# EAGLE schematic XMICRO-6502 (EAGLE 6.3)

## Sheet 1 of 6: CPU
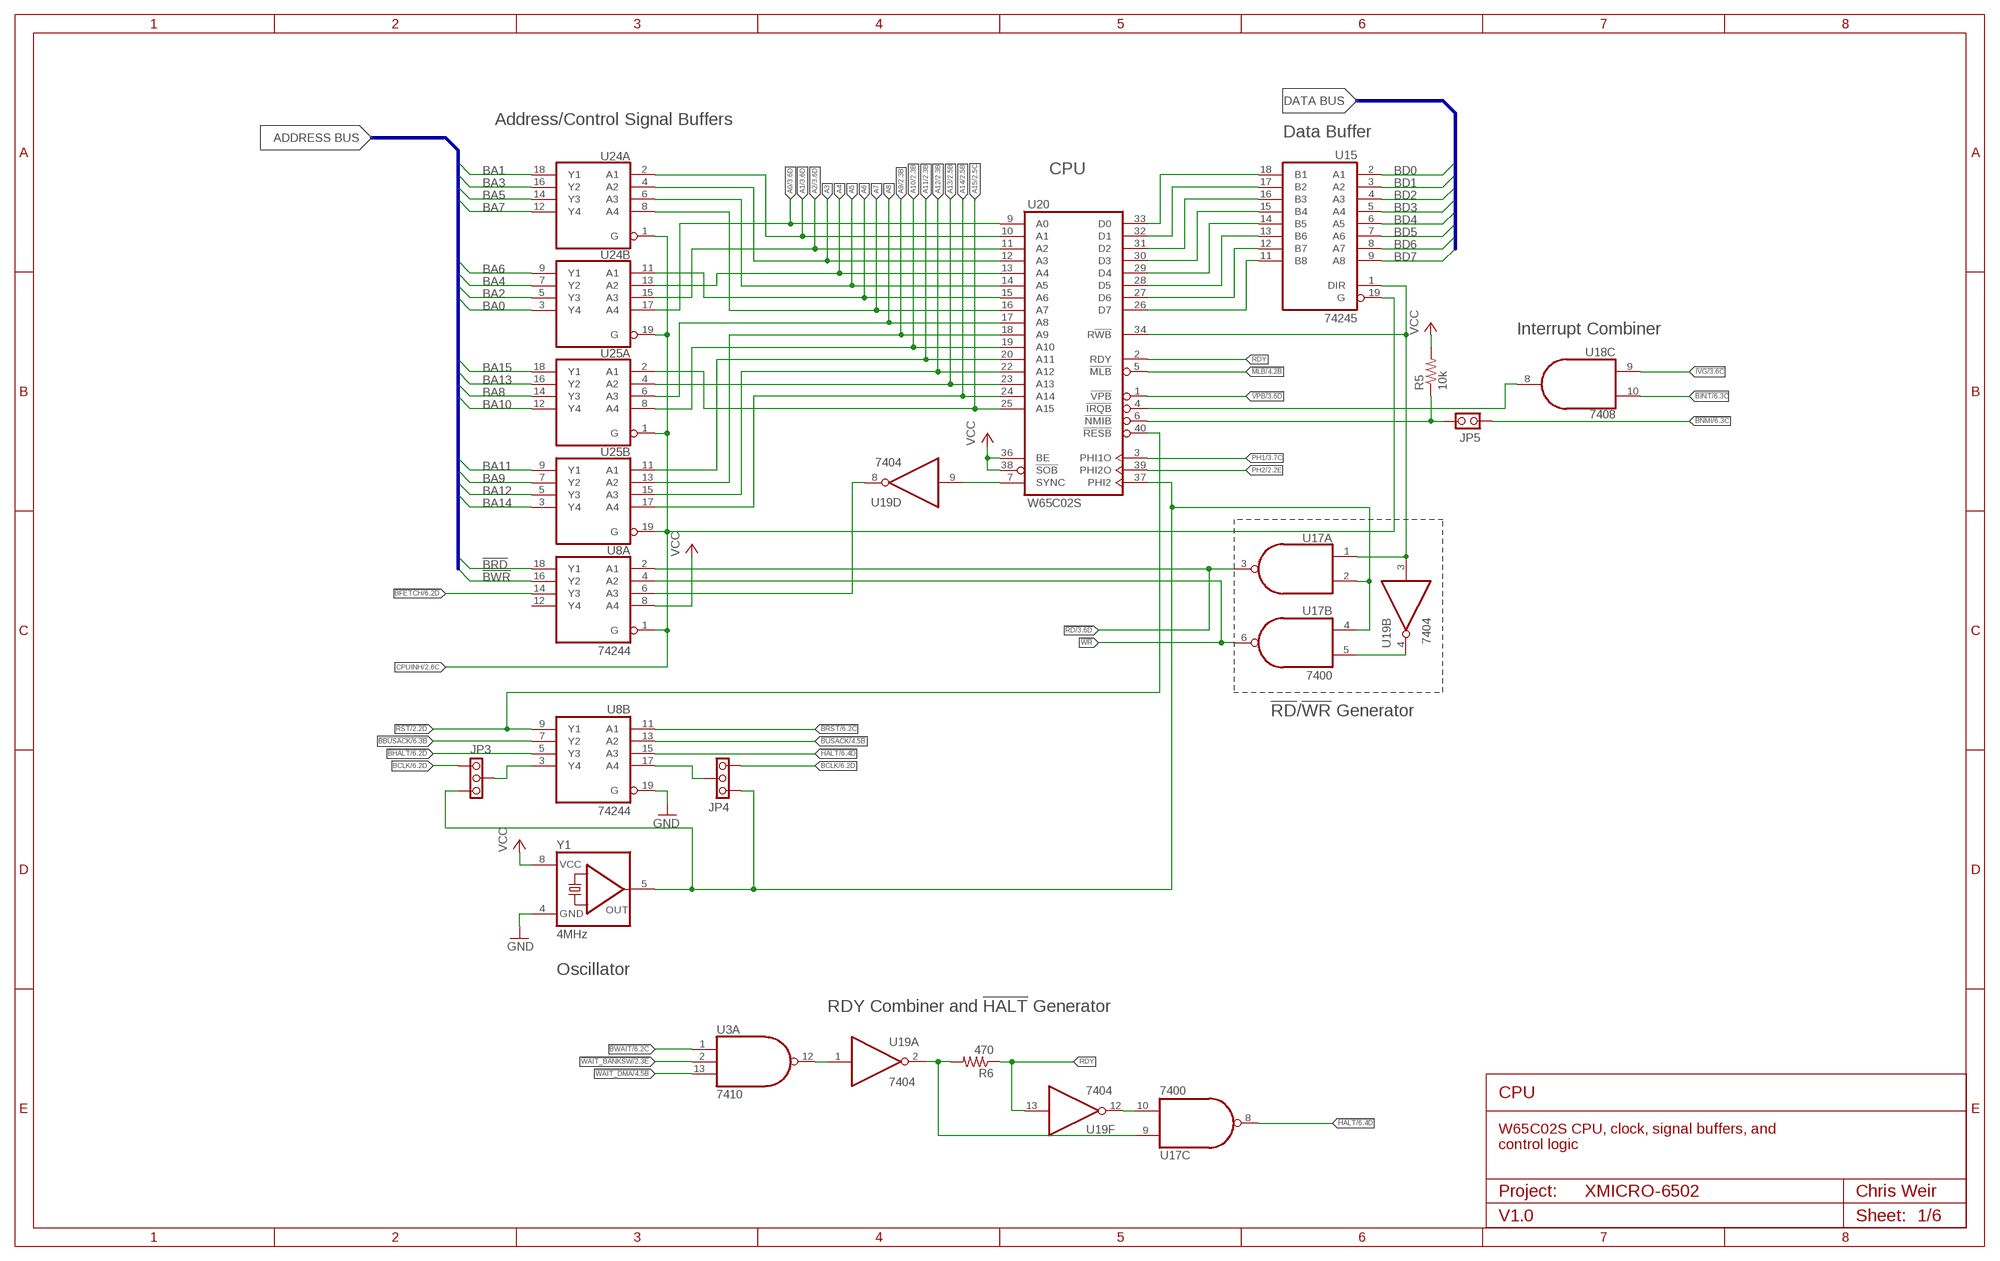
[diagram p0: schematic, sheet 1]

### Parts
JP3  PINHD1X3THRU  [1X03]
JP4  PINHD1X3THRU  [1X03]
JP5  PINHD-1X2THRU  [1X02]
R5  10k  R-US_0207/10  [0207/10]
R6  470  R-US_0207/10  [0207/10]
U3  7410  74LS10N  [DIL14]
U8  74244  74LS244N  [DIL20]
U15  74245  74LS245N  [DIL20]
U17  7400  74LS00N  [DIL14]
U18  7408  74LS08N  [DIL14]
U19  7404  74LS04N  [DIL14]
U20  W65C02S  W65C02P  [DIL40]
U24  74244  74LS244N  [DIL20]
U25  74244  74LS244N  [DIL20]
Y1  4MHz  QG5460  [DIL08S]

### Nets
!BBUSACK: U8.7(B:Y2) ; also sheet 6
!BFETCH: U8.14(A:Y3) ; also sheet 6
!BHALT: U8.5(B:Y3) ; also sheet 6
!BINT: U18.10(C:I1) ; also sheet 6
!BNMI: JP5.1 ; also sheet 6
!BRD: U8.18(A:Y1) ; also sheet 5,6
!BRST: U8.11(B:A1) ; also sheet 6
!BUSACK: U8.13(B:A2) ; also sheet 4
!BWAIT: U3.1(A:I0) ; also sheet 6
!BWR: U8.16(A:Y2) ; also sheet 5,6
!CINT: U18.8(C:O) U20.4(!IRQB)
!HALT: U8.15(B:A3) U17.8(C:O) ; also sheet 6
!IVG: U18.9(C:I0) ; also sheet 3
!MLB: U20.5(!MLB) ; also sheet 4
!RD: U8.2(A:A1) U17.3(A:O) ; also sheet 3
!RST: U8.9(B:Y1) U20.40(!RESB) ; also sheet 2,3,4
!VPB: U20.1(!VPB) ; also sheet 3
!WAIT_BANKSW: U3.2(A:I1) ; also sheet 2
!WAIT_DMA: U3.13(A:I2) ; also sheet 4
!WR: U8.4(A:A2) U17.6(B:O)
A0: U20.9(A0) U24.17(B:A4) ; also sheet 3
A1: U20.10(A1) U24.2(A:A1) ; also sheet 3
A2: U20.11(A2) U24.15(B:A3) ; also sheet 3
A3: U20.12(A3) U24.4(A:A2)
A4: U20.13(A4) U24.13(B:A2)
A5: U20.14(A5) U24.6(A:A3)
A6: U20.15(A6) U24.11(B:A1)
A7: U20.16(A7) U24.8(A:A4)
A8: U20.17(A8) U25.6(A:A3)
A9: U20.18(A9) U25.13(B:A2) ; also sheet 2
A10: U20.19(A10) U25.8(A:A4) ; also sheet 2
A11: U20.20(A11) U25.11(B:A1) ; also sheet 2
A12: U20.22(A12) U25.15(B:A3) ; also sheet 2
A13: U20.23(A13) U25.4(A:A2) ; also sheet 2
A14: U20.24(A14) U25.17(B:A4) ; also sheet 2
A15: U20.25(A15) U25.2(A:A1) ; also sheet 2
BA0: U24.3(B:Y4) ; also sheet 5,6
BA1: U24.18(A:Y1) ; also sheet 6
BA2: U24.5(B:Y3) ; also sheet 6
BA3: U24.16(A:Y2) ; also sheet 6
BA4: U24.7(B:Y2) ; also sheet 6
BA5: U24.14(A:Y3) ; also sheet 5,6
BA6: U24.9(B:Y1) ; also sheet 5,6
BA7: U24.12(A:Y4) ; also sheet 5,6
BA8: U25.14(A:Y3) ; also sheet 6
BA9: U25.7(B:Y2) ; also sheet 6
BA10: U25.12(A:Y4) ; also sheet 6
BA11: U25.9(B:Y1) ; also sheet 6
BA12: U25.5(B:Y3) ; also sheet 6
BA13: U25.16(A:Y2) ; also sheet 6
BA14: U25.3(B:Y4) ; also sheet 6
BA15: U25.18(A:Y1) ; also sheet 6
BCLK: JP3.1 JP4.3 ; also sheet 6
BD0: U15.2(A1) ; also sheet 2,3,5,6
BD1: U15.3(A2) ; also sheet 2,3,5,6
BD2: U15.4(A3) ; also sheet 2,3,5,6
BD3: U15.5(A4) ; also sheet 2,3,5,6
BD4: U15.6(A5) ; also sheet 2,3,5,6
BD5: U15.7(A6) ; also sheet 2,3,5,6
BD6: U15.8(A7) ; also sheet 2,3,5,6
BD7: U15.9(A8) ; also sheet 2,3,5,6
CPUINH: U8.1(A:G) U15.19(G) U24.1(A:G) U24.19(B:G) U25.1(A:G) U25.19(B:G) ; also sheet 2,4
GND [GND]: U8.19(B:G) Y1.4(GND) ; also sheet 2,3,4,6
N$1: U3.12(A:O) U19.1(A:I)
N$2: U17.5(B:I1) U19.4(B:O)
N$4: U15.1(DIR) U17.1(A:I0) U19.3(B:I) U20.34(R!WB)
N$9: JP3.2 U8.3(B:Y4)
N$11: U17.10(C:I1) U19.12(F:O)
N$21: R6.2 U17.9(C:I0) U19.2(A:O)
N$28: U15.11(B8) U20.26(D7)
N$29: U15.12(B7) U20.27(D6)
N$30: U15.13(B6) U20.28(D5)
N$31: U15.14(B5) U20.29(D4)
N$32: U15.15(B4) U20.30(D3)
N$33: U15.16(B3) U20.31(D2)
N$34: U15.17(B2) U20.32(D1)
N$35: U15.18(B1) U20.33(D0)
N$36: JP4.2 U8.17(B:A4)
N$37: JP5.2 R5.1 U20.6(!NMIB)
N$49: U19.9(D:I) U20.7(SYNC)
N$51: U8.6(A:A3) U19.8(D:O)
PH0: JP3.3 JP4.1 U17.2(A:I1) U17.4(B:I0) U20.37(PHI2) Y1.5(OUT)
PH1: U20.3(PHI1O) ; also sheet 3,4
PH2: U20.39(PHI2O) ; also sheet 2,4
RDY: R6.1 U19.13(F:I) U20.2(RDY)
VCC: R5.2 U8.8(A:A4) U20.36(BE) U20.38(!SOB) Y1.8(VCC) ; also sheet 2,3,4,5,6
Unconnected: U8.12(A:Y4)

### Buses
BD[0..7]
BA[0..19],!BRD,!BWR,!BCSX

### Notes on the sheet
- DATA BUS
- Address/Control Signal Buffers
- ADDRESS BUS | Data Buffer
- CPU
- Interrupt Combiner
- !RD!/!WR! Generator
- Oscillator
- RDY Combiner and !HALT! Generator
- CPU
- W65C02S CPU, clock, signal buffers, and
  control logic
- Project: | Chris Weir
- V1.0 | Sheet:

## Sheet 2 of 6: Bank Switcher
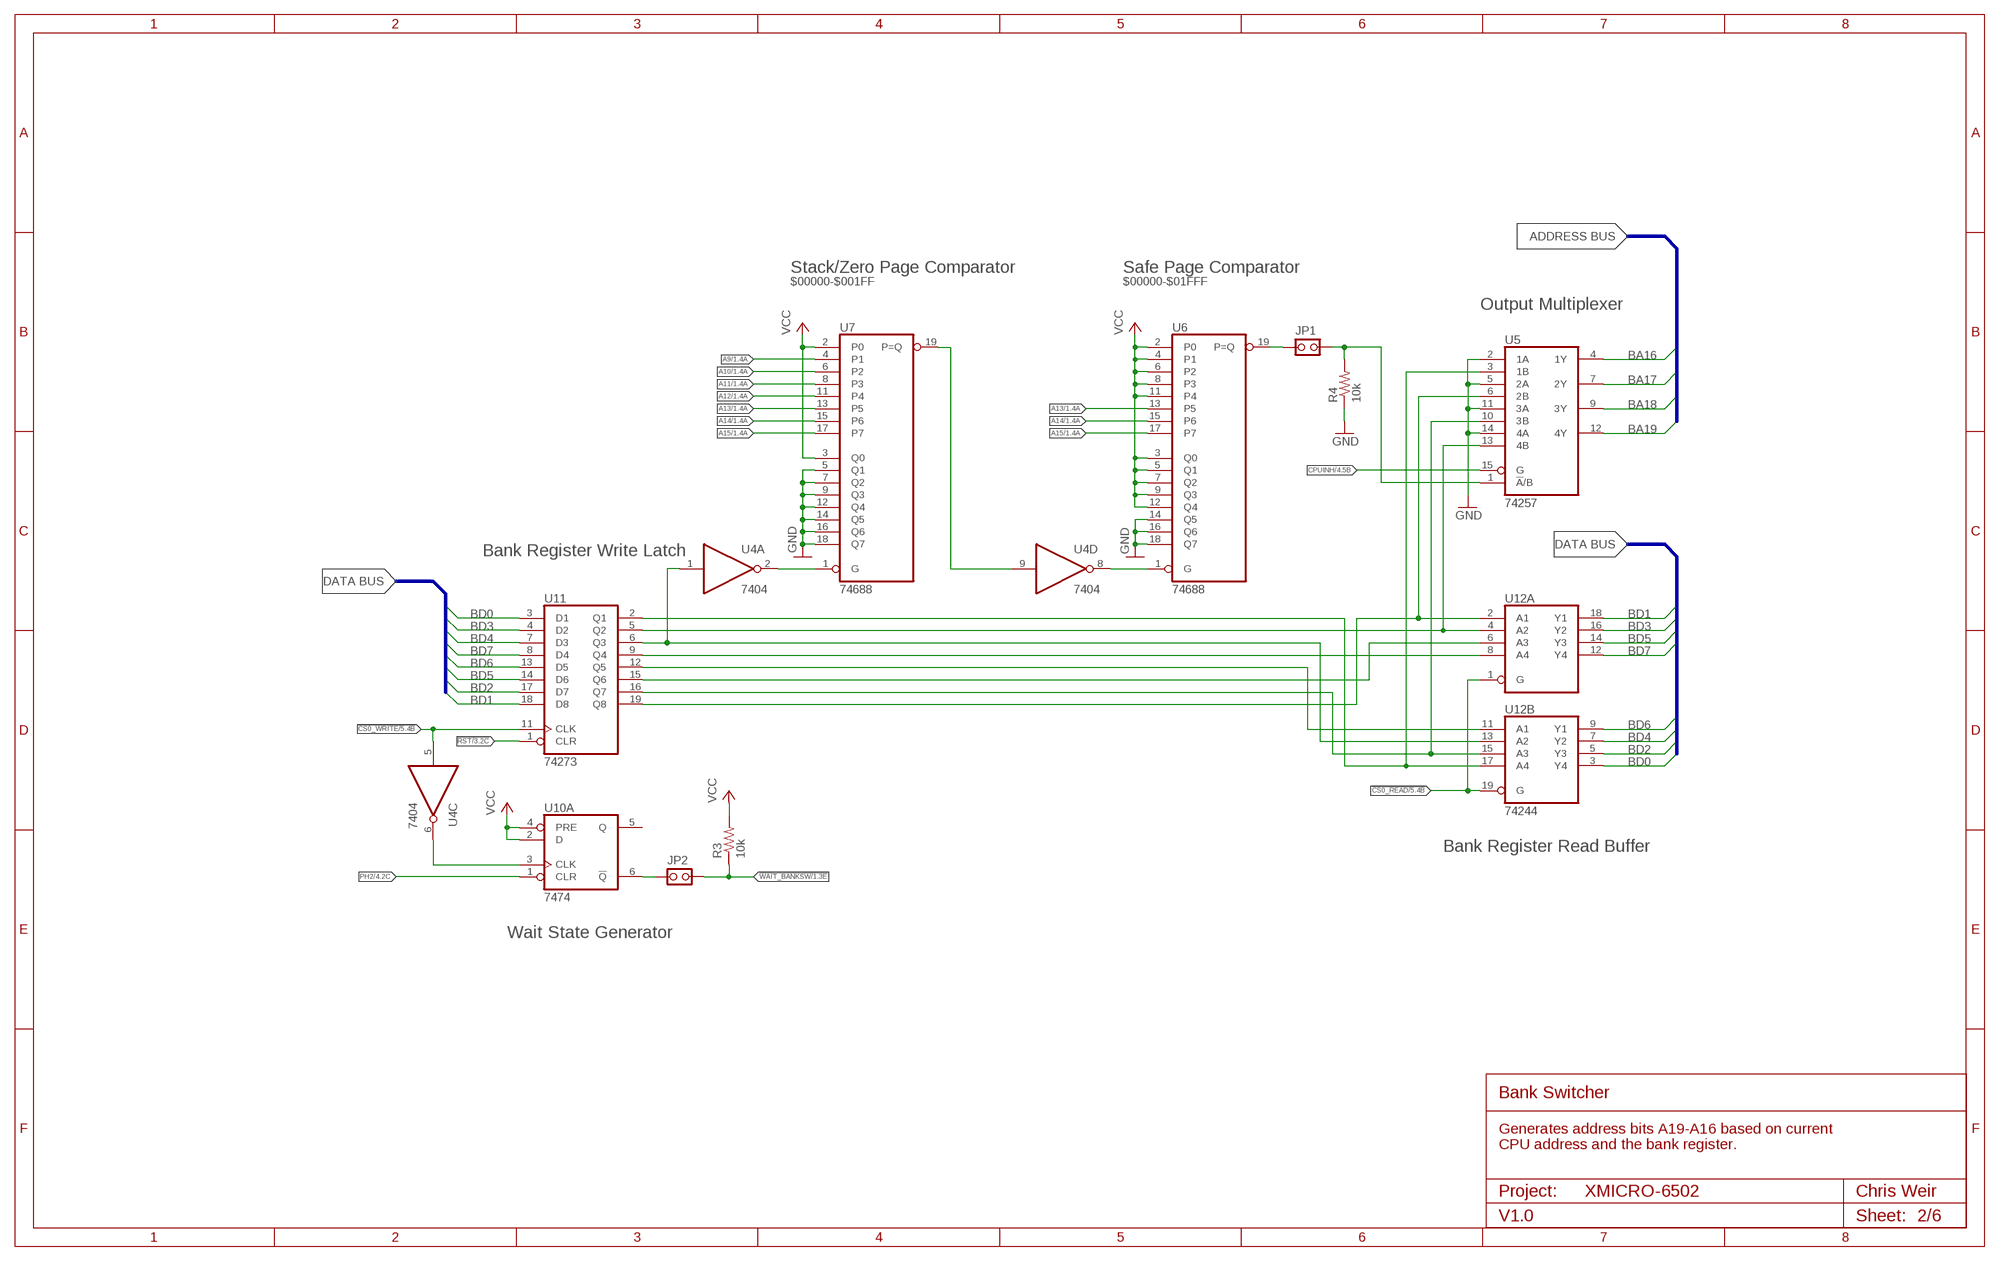
[diagram p1: schematic, sheet 2]

### Parts
JP1  PINHD-1X2THRU  [1X02]
JP2  PINHD-1X2THRU  [1X02]
R3  10k  R-US_0207/10  [0207/10]
R4  10k  R-US_0207/10  [0207/10]
U4  7404  74LS04N  [DIL14]
U5  74257  74LS257N  [DIL16]
U6  74688  74LS688N  [DIL20]
U7  74688  74LS688N  [DIL20]
U10  7474  74LS74N  [DIL14]
U11  74273  74273N  [DIL20]
U12  74244  74LS244N  [DIL20]

### Nets
!CS0_READ: U12.1(A:G) U12.19(B:G) ; also sheet 5
!CS0_WRITE: U4.5(C:I) U11.11(CLK) ; also sheet 5
!RST: U11.1(CLR) ; also sheet 1,3,4
!WAIT_BANKSW: JP2.2 R3.1 ; also sheet 1
A9: U7.4(P1) ; also sheet 1
A10: U7.6(P2) ; also sheet 1
A11: U7.8(P3) ; also sheet 1
A12: U7.11(P4) ; also sheet 1
A13: U6.13(P5) U7.13(P5) ; also sheet 1
A14: U6.15(P6) U7.15(P6) ; also sheet 1
A15: U6.17(P7) U7.17(P7) ; also sheet 1
BA16: U5.4(1Y) ; also sheet 6
BA17: U5.7(2Y) ; also sheet 6
BA18: U5.9(3Y) ; also sheet 6
BA19: U5.12(4Y) ; also sheet 6
BD0: U11.3(D1) U12.3(B:Y4) ; also sheet 1,3,5,6
BD1: U11.18(D8) U12.18(A:Y1) ; also sheet 1,3,5,6
BD2: U11.17(D7) U12.5(B:Y3) ; also sheet 1,3,5,6
BD3: U11.4(D2) U12.16(A:Y2) ; also sheet 1,3,5,6
BD4: U11.7(D3) U12.7(B:Y2) ; also sheet 1,3,5,6
BD5: U11.14(D6) U12.14(A:Y3) ; also sheet 1,3,5,6
BD6: U11.13(D5) U12.9(B:Y1) ; also sheet 1,3,5,6
BD7: U11.8(D4) U12.12(A:Y4) ; also sheet 1,3,5,6
CPUINH: U5.15(G) ; also sheet 1,4
GND [GND]: R4.1 U5.2(1A) U5.5(2A) U5.11(3A) U5.14(4A) U6.14(Q5) U6.16(Q6) U6.18(Q7) U7.5(Q1) U7.7(Q2) U7.9(Q3) U7.12(Q4) U7.14(Q5) U7.16(Q6) U7.18(Q7) ; also sheet 1,3,4,6
N$3: JP2.1 U10.6(A:!Q)
N$5: JP1.2 R4.2 U5.1(!A!/B)
N$8: U4.6(C:O) U10.3(A:CLK)
N$10: U4.1(A:I) U11.6(Q3) U12.13(B:A2)
N$19: U4.8(D:O) U6.1(G)
N$27: JP1.1 U6.19(P=Q)
N$40: U5.3(1B) U11.2(Q1) U12.17(B:A4)
N$41: U5.6(2B) U11.19(Q8) U12.2(A:A1)
N$42: U5.10(3B) U11.16(Q7) U12.15(B:A3)
N$43: U5.13(4B) U11.5(Q2) U12.4(A:A2)
N$45: U11.15(Q6) U12.6(A:A3)
N$53: U4.9(D:I) U7.19(P=Q)
N$56: U11.12(Q5) U12.11(B:A1)
N$57: U11.9(Q4) U12.8(A:A4)
N$61: U4.2(A:O) U7.1(G)
PH2: U10.1(A:CLR) ; also sheet 1,4
VCC: R3.2 U6.2(P0) U6.3(Q0) U6.4(P1) U6.5(Q1) U6.6(P2) U6.7(Q2) U6.8(P3) U6.9(Q3) U6.11(P4) U6.12(Q4) U7.2(P0) U7.3(Q0) U10.2(A:D) U10.4(A:PRE) ; also sheet 1,3,4,5,6
Unconnected: U10.5(A:Q)

### Buses
BD[0..7]
BA[0..19],!BRD,!BWR,!BCSX

### Notes on the sheet
- ADDRESS BUS
- Stack/Zero Page Comparator | Safe Page Comparator
- $00000-$001FF | $00000-$01FFF
- Output Multiplexer
- DATA BUS
- Bank Register Write Latch
- DATA BUS
- Bank Register Read Buffer
- Wait State Generator
- Bank Switcher
- Generates address bits A19-A16 based on current
  CPU address and the bank register.
- Project: | Chris Weir
- V1.0 | Sheet:

## Sheet 3 of 6: Interrupt Vector Generator
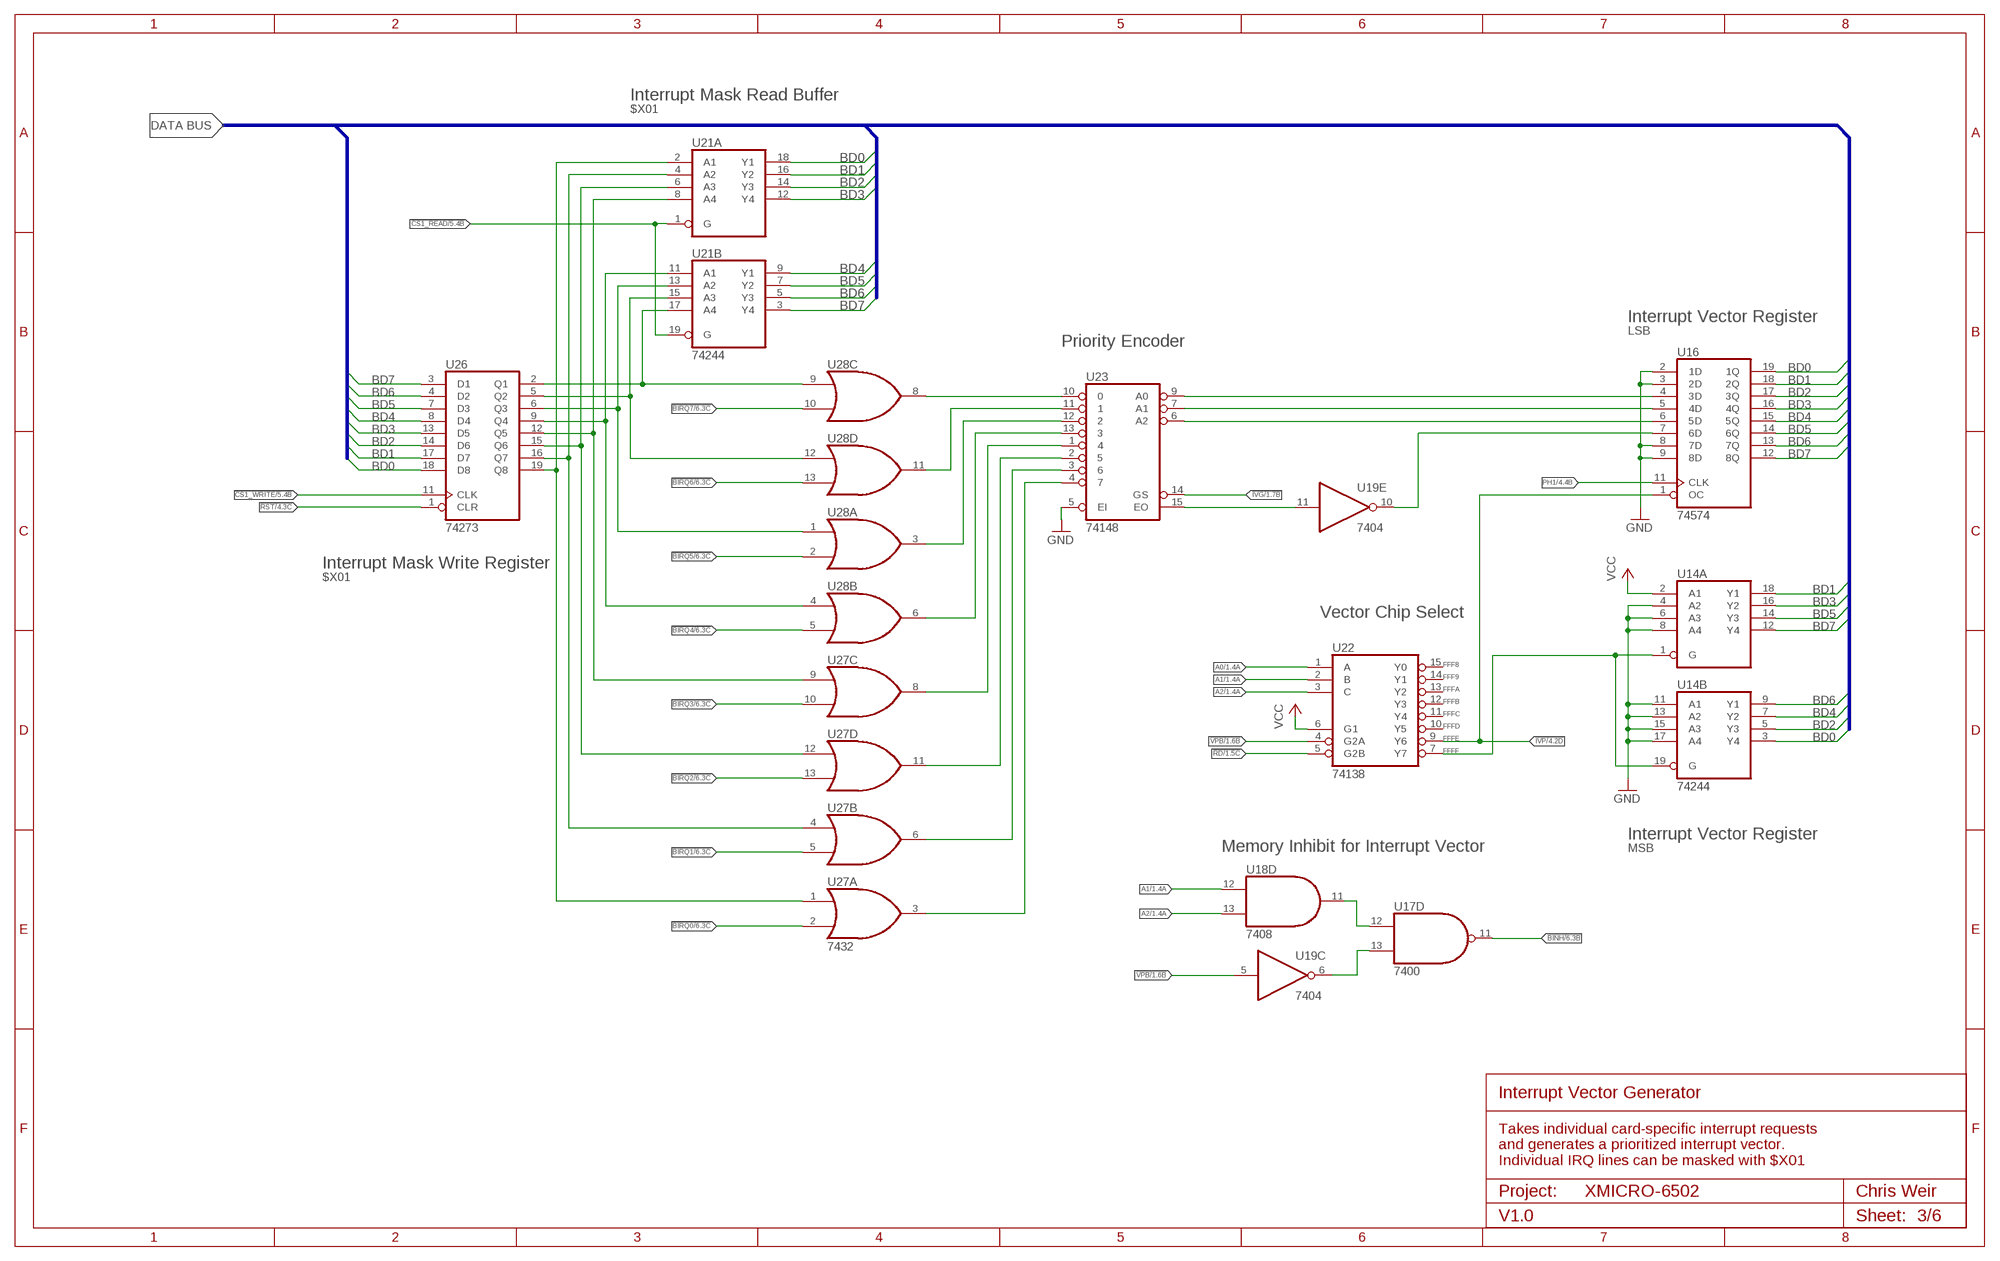
[diagram p2: schematic, sheet 3]

### Parts
U14  74244  74LS244N  [DIL20]
U16  74574  74HC574N  [DIL20]
U21  74244  74LS244N  [DIL20]
U22  74138  74LS138N  [DIL16]
U23  74148  74LS148N  [DIL16]
U26  74273  74273N  [DIL20]
U27  7432  74LS32N  [DIL14]
U28  7432  74LS32N  [DIL14]

### Nets
!BINH: U17.11(D:O) ; also sheet 6
!BIRQ0: U27.2(A:I1) ; also sheet 6
!BIRQ1: U27.5(B:I1) ; also sheet 6
!BIRQ2: U27.13(D:I1) ; also sheet 6
!BIRQ3: U27.10(C:I1) ; also sheet 6
!BIRQ4: U28.5(B:I1) ; also sheet 6
!BIRQ5: U28.2(A:I1) ; also sheet 6
!BIRQ6: U28.13(D:I1) ; also sheet 6
!BIRQ7: U28.10(C:I1) ; also sheet 6
!CS1_READ: U21.1(A:G) U21.19(B:G) ; also sheet 5
!CS1_WRITE: U26.11(CLK) ; also sheet 5
!IVG: U23.14(GS) ; also sheet 1
!IVP: U16.1(OC) U22.9(Y6) ; also sheet 4
!RD: U22.5(G2B) ; also sheet 1
!RST: U26.1(CLR) ; also sheet 1,2,4
!VPB: U19.5(C:I) U22.4(G2A) ; also sheet 1
A0: U22.1(A) ; also sheet 1
A1: U18.12(D:I0) U22.2(B) ; also sheet 1
A2: U18.13(D:I1) U22.3(C) ; also sheet 1
BD0: U14.3(B:Y4) U16.19(1Q) U21.18(A:Y1) U26.18(D8) ; also sheet 1,2,5,6
BD1: U14.18(A:Y1) U16.18(2Q) U21.16(A:Y2) U26.17(D7) ; also sheet 1,2,5,6
BD2: U14.5(B:Y3) U16.17(3Q) U21.14(A:Y3) U26.14(D6) ; also sheet 1,2,5,6
BD3: U14.16(A:Y2) U16.16(4Q) U21.12(A:Y4) U26.13(D5) ; also sheet 1,2,5,6
BD4: U14.7(B:Y2) U16.15(5Q) U21.9(B:Y1) U26.8(D4) ; also sheet 1,2,5,6
BD5: U14.14(A:Y3) U16.14(6Q) U21.7(B:Y2) U26.7(D3) ; also sheet 1,2,5,6
BD6: U14.9(B:Y1) U16.13(7Q) U21.5(B:Y3) U26.4(D2) ; also sheet 1,2,5,6
BD7: U14.12(A:Y4) U16.12(8Q) U21.3(B:Y4) U26.3(D1) ; also sheet 1,2,5,6
GND [GND]: U14.4(A:A2) U14.6(A:A3) U14.8(A:A4) U14.11(B:A1) U14.13(B:A2) U14.15(B:A3) U14.17(B:A4) U16.2(1D) U16.3(2D) U16.8(7D) U16.9(8D) U23.5(EI) ; also sheet 1,2,4,6
N$6: U16.4(3D) U23.9(A0)
N$7: U16.5(4D) U23.7(A1)
N$13: U19.11(E:I) U23.15(EO)
N$14: U17.13(D:I1) U19.6(C:O)
N$15: U14.1(A:G) U14.19(B:G) U22.7(Y7)
N$18: U16.6(5D) U23.6(A2)
N$22: U17.12(D:I0) U18.11(D:O)
N$52: U23.10 U28.8(C:O)
N$55: U16.7(6D) U19.10(E:O)
N$92: U23.11 U28.11(D:O)
N$93: U23.12 U28.3(A:O)
N$94: U23.13 U28.6(B:O)
N$95: U23.1 U27.8(C:O)
N$96: U23.2 U27.11(D:O)
N$97: U23.3 U27.6(B:O)
N$98: U23.4 U27.3(A:O)
N$99: U21.17(B:A4) U26.2(Q1) U28.9(C:I0)
N$100: U21.15(B:A3) U26.5(Q2) U28.12(D:I0)
N$101: U21.13(B:A2) U26.6(Q3) U28.1(A:I0)
N$102: U21.11(B:A1) U26.9(Q4) U28.4(B:I0)
N$103: U21.8(A:A4) U26.12(Q5) U27.9(C:I0)
N$104: U21.6(A:A3) U26.15(Q6) U27.12(D:I0)
N$105: U21.4(A:A2) U26.16(Q7) U27.4(B:I0)
N$106: U21.2(A:A1) U26.19(Q8) U27.1(A:I0)
PH1: U16.11(CLK) ; also sheet 1,4
VCC: U14.2(A:A1) U22.6(G1) ; also sheet 1,2,4,5,6
Unconnected: U22.10(Y5) U22.11(Y4) U22.12(Y3) U22.13(Y2) U22.14(Y1) U22.15(Y0)

### Buses
BD[0..7]

### Notes on the sheet
- Interrupt Mask Read Buffer
- $X01
- DATA BUS
- Interrupt Vector Register
- LSB
- Priority Encoder
- Interrupt Mask Write Register
- $X01
- Vector Chip Select
- FFF8
- FFF9
- FFFA
- FFFB
- FFFC
- FFFD
- FFFE
- FFFF
- Interrupt Vector Register
- Memory Inhibit for Interrupt Vector | MSB
- Interrupt Vector Generator
- Takes individual card-specific interrupt requests
  and generates a prioritized interrupt vector.
  Individual IRQ lines can be masked with $X01
- Project: | Chris Weir
- V1.0 | Sheet:

## Sheet 4 of 6: DMA System
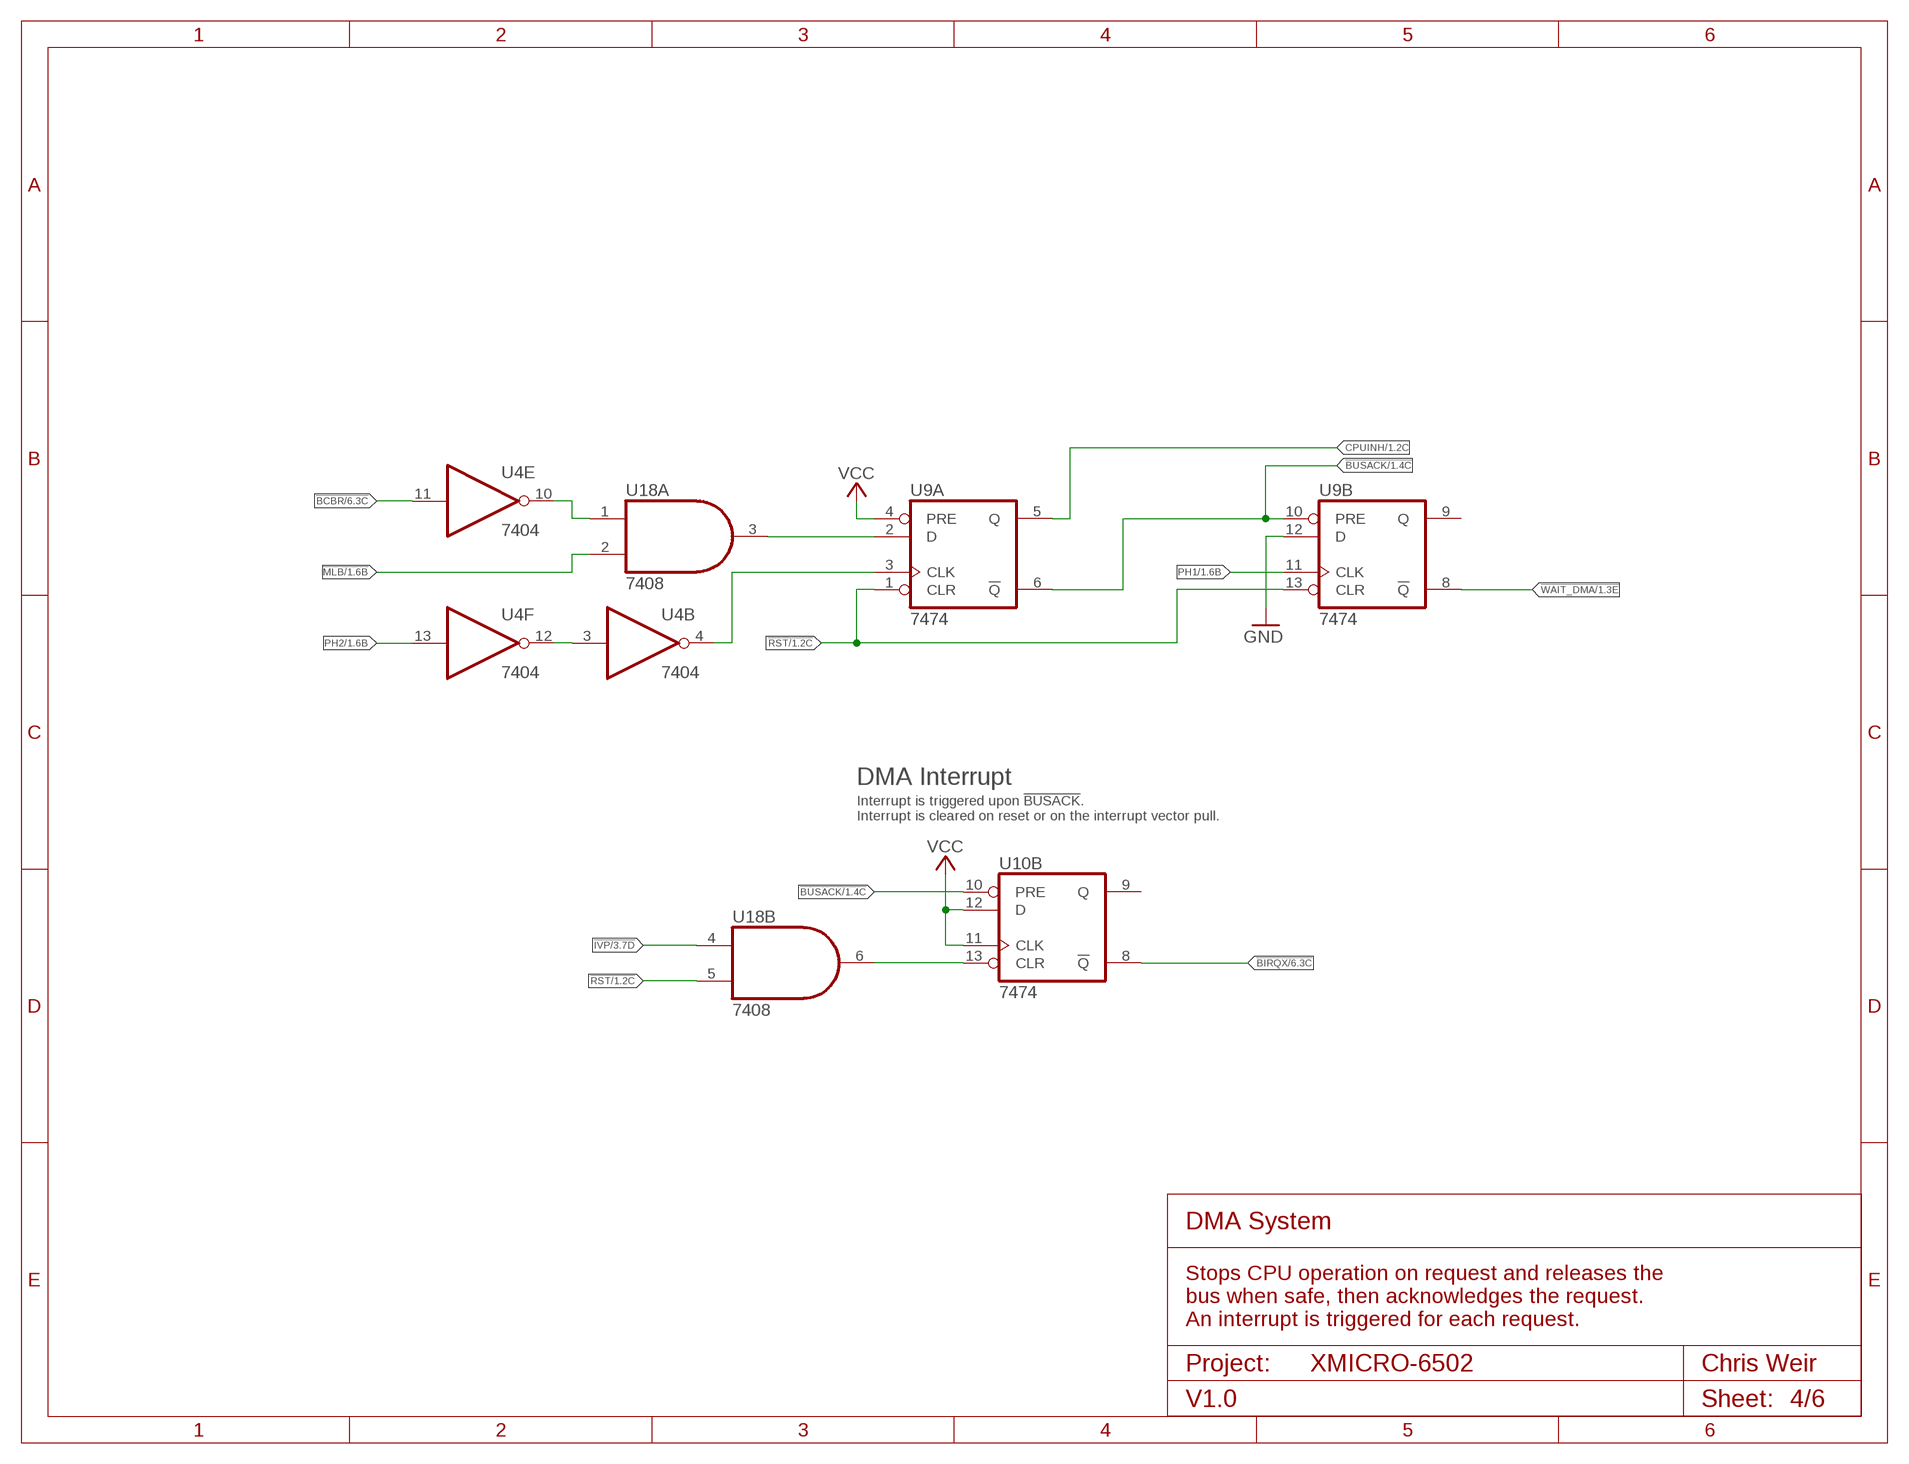
[diagram p3: schematic, sheet 4]

### Parts
U9  7474  74LS74N  [DIL14]

### Nets
!BCBR: U4.11(E:I) ; also sheet 6
!BIRQX: U10.8(B:!Q) ; also sheet 6
!BUSACK: U9.6(A:!Q) U9.10(B:PRE) U10.10(B:PRE) ; also sheet 1
!IVP: U18.4(B:I0) ; also sheet 3
!MLB: U18.2(A:I1) ; also sheet 1
!RST: U9.1(A:CLR) U9.13(B:CLR) U18.5(B:I1) ; also sheet 1,2,3
!WAIT_DMA: U9.8(B:!Q) ; also sheet 1
CPUINH: U9.5(A:Q) ; also sheet 1,2
GND [GND]: U9.12(B:D) ; also sheet 1,2,3,6
N$12: U9.2(A:D) U18.3(A:O)
N$16: U10.13(B:CLR) U18.6(B:O)
N$17: U4.10(E:O) U18.1(A:I0)
N$23: U4.3(B:I) U4.12(F:O)
N$25: U4.4(B:O) U9.3(A:CLK)
PH1: U9.11(B:CLK) ; also sheet 1,3
PH2: U4.13(F:I) ; also sheet 1,2
VCC: U9.4(A:PRE) U10.11(B:CLK) U10.12(B:D) ; also sheet 1,2,3,5,6
Unconnected: U9.9(B:Q) U10.9(B:Q)

### Notes on the sheet
- DMA Interrupt
- Interrupt is triggered upon !BUSACK!.
  Interrupt is cleared on reset or on the interrupt vector pull.
- DMA System
- Stops CPU operation on request and releases the
  bus when safe, then acknowledges the request.
  An interrupt is triggered for each request.
- Project: | Chris Weir
- V1.0 | Sheet:

## Sheet 5 of 6: Chip Selects
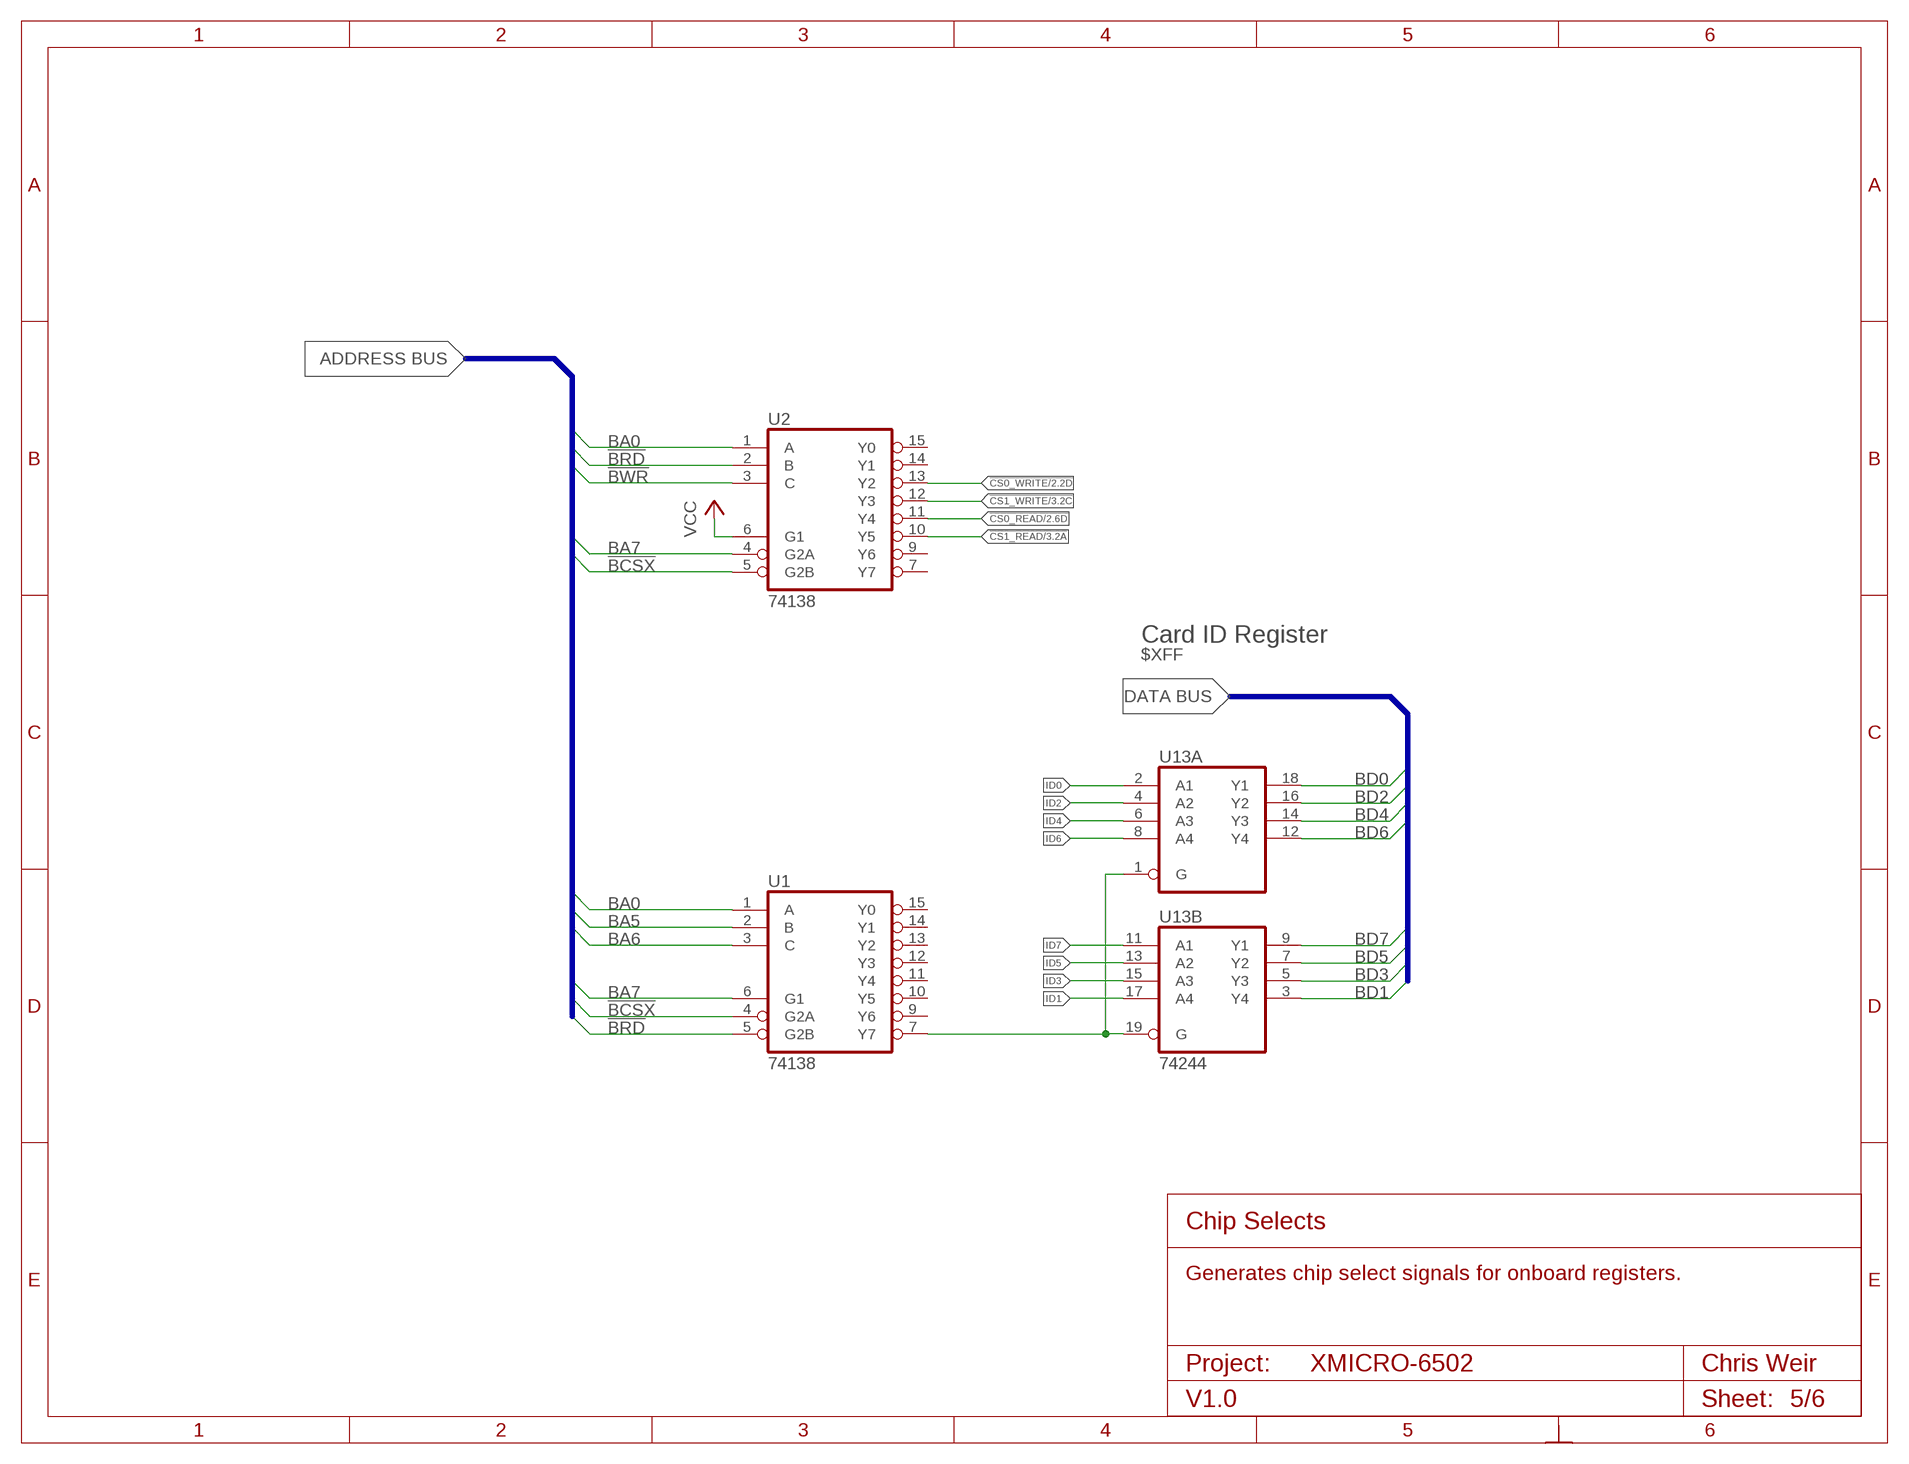
[diagram p4: schematic, sheet 5]

### Parts
U1  74138  74LS138N  [DIL16]
U2  74138  74LS138N  [DIL16]
U13  74244  74LS244N  [DIL20]

### Nets
!BCSX: U1.4(G2A) U2.5(G2B) ; also sheet 6
!BRD: U1.5(G2B) U2.2(B) ; also sheet 1,6
!BWR: U2.3(C) ; also sheet 1,6
!CS0_READ: U2.11(Y4) ; also sheet 2
!CS0_WRITE: U2.13(Y2) ; also sheet 2
!CS1_READ: U2.10(Y5) ; also sheet 3
!CS1_WRITE: U2.12(Y3) ; also sheet 3
BA0: U1.1(A) U2.1(A) ; also sheet 1,6
BA5: U1.2(B) ; also sheet 1,6
BA6: U1.3(C) ; also sheet 1,6
BA7: U1.6(G1) U2.4(G2A) ; also sheet 1,6
BD0: U13.18(A:Y1) ; also sheet 1,2,3,6
BD1: U13.3(B:Y4) ; also sheet 1,2,3,6
BD2: U13.16(A:Y2) ; also sheet 1,2,3,6
BD3: U13.5(B:Y3) ; also sheet 1,2,3,6
BD4: U13.14(A:Y3) ; also sheet 1,2,3,6
BD5: U13.7(B:Y2) ; also sheet 1,2,3,6
BD6: U13.12(A:Y4) ; also sheet 1,2,3,6
BD7: U13.9(B:Y1) ; also sheet 1,2,3,6
ID0: U13.2(A:A1)
ID1: U13.17(B:A4)
ID2: U13.4(A:A2)
ID3: U13.15(B:A3)
ID4: U13.6(A:A3)
ID5: U13.13(B:A2)
ID6: U13.8(A:A4)
ID7: U13.11(B:A1)
N$50: U1.7(Y7) U13.1(A:G) U13.19(B:G)
VCC: U2.6(G1) ; also sheet 1,2,3,4,6
Unconnected: U1.9(Y6) U1.10(Y5) U1.11(Y4) U1.12(Y3) U1.13(Y2) U1.14(Y1) U1.15(Y0) U2.7(Y7) U2.9(Y6) U2.14(Y1) U2.15(Y0)

### Buses
BD[0..7]
BA[0..19],!BRD,!BWR,!BCSX

### Notes on the sheet
- ADDRESS BUS
- Card ID Register
- $XFF
- DATA BUS
- Chip Selects
- Generates chip select signals for onboard registers.
- Project: | Chris Weir
- V1.0 | Sheet:

## Sheet 6 of 6: Bus Connector/Misc.
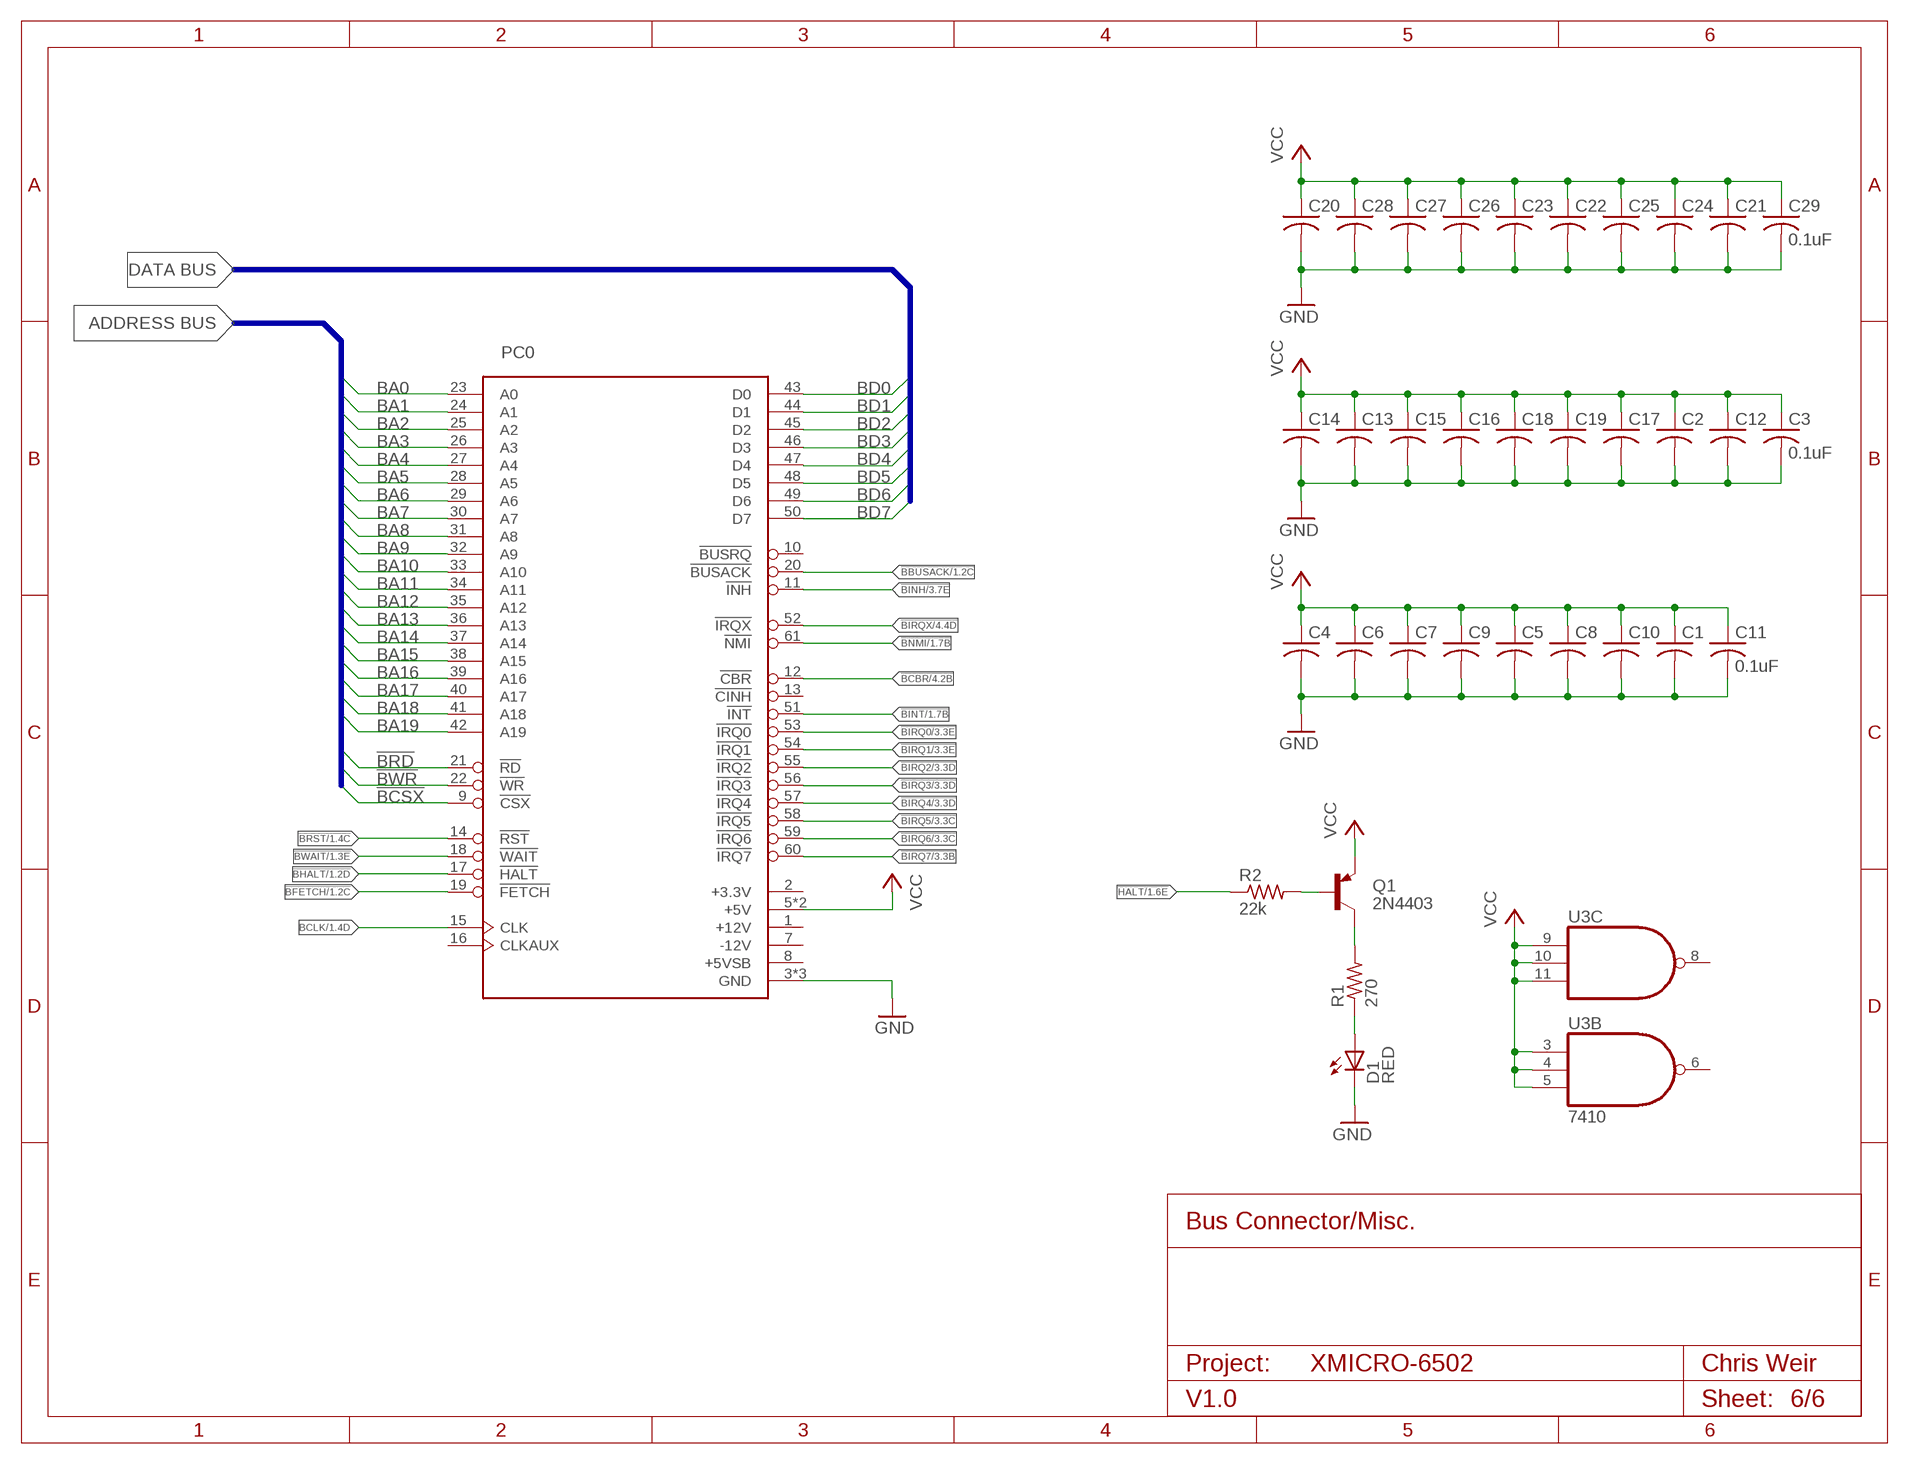
[diagram p5: schematic, sheet 6]

### Parts
C1  0.1uF  C-US025-024X044  [C025-024X044]
C2  0.1uF  C-US025-024X044  [C025-024X044]
C3  0.1uF  C-US025-024X044  [C025-024X044]
C4  0.1uF  C-US025-024X044  [C025-024X044]
C5  0.1uF  C-US025-024X044  [C025-024X044]
C6  0.1uF  C-US025-024X044  [C025-024X044]
C7  0.1uF  C-US025-024X044  [C025-024X044]
C8  0.1uF  C-US025-024X044  [C025-024X044]
C9  0.1uF  C-US025-024X044  [C025-024X044]
C10  0.1uF  C-US025-024X044  [C025-024X044]
C11  0.1uF  C-US025-024X044  [C025-024X044]
C12  0.1uF  C-US025-024X044  [C025-024X044]
C13  0.1uF  C-US025-024X044  [C025-024X044]
C14  0.1uF  C-US025-024X044  [C025-024X044]
C15  0.1uF  C-US025-024X044  [C025-024X044]
C16  0.1uF  C-US025-024X044  [C025-024X044]
C17  0.1uF  C-US025-024X044  [C025-024X044]
C18  0.1uF  C-US025-024X044  [C025-024X044]
C19  0.1uF  C-US025-024X044  [C025-024X044]
C20  0.1uF  C-US025-024X044  [C025-024X044]
C21  0.1uF  C-US025-024X044  [C025-024X044]
C22  0.1uF  C-US025-024X044  [C025-024X044]
C23  0.1uF  C-US025-024X044  [C025-024X044]
C24  0.1uF  C-US025-024X044  [C025-024X044]
C25  0.1uF  C-US025-024X044  [C025-024X044]
C26  0.1uF  C-US025-024X044  [C025-024X044]
C27  0.1uF  C-US025-024X044  [C025-024X044]
C28  0.1uF  C-US025-024X044  [C025-024X044]
C29  0.1uF  C-US025-024X044  [C025-024X044]
D1  RED  LED5MM  [LED5MM]
PC0  XMICRO-BUS-EDGE62M  [EDGE62M]
Q1  2N4403  TRANSISTOR-PNP-2N4403  [TO92]
R1  270  R-US_0207/10  [0207/10]
R2  22k  R-US_0207/10  [0207/10]

### Nets
!BBUSACK: PC0.20(!BUSACK) ; also sheet 1
!BCBR: PC0.12(!CBR) ; also sheet 4
!BCSX: PC0.9(!CSX) ; also sheet 5
!BFETCH: PC0.19(!FETCH) ; also sheet 1
!BHALT: PC0.17(!HALT) ; also sheet 1
!BINH: PC0.11(!INH) ; also sheet 3
!BINT: PC0.51(!INT) ; also sheet 1
!BIRQ0: PC0.53(!IRQ0) ; also sheet 3
!BIRQ1: PC0.54(!IRQ1) ; also sheet 3
!BIRQ2: PC0.55(!IRQ2) ; also sheet 3
!BIRQ3: PC0.56(!IRQ3) ; also sheet 3
!BIRQ4: PC0.57(!IRQ4) ; also sheet 3
!BIRQ5: PC0.58(!IRQ5) ; also sheet 3
!BIRQ6: PC0.59(!IRQ6) ; also sheet 3
!BIRQ7: PC0.60(!IRQ7) ; also sheet 3
!BIRQX: PC0.52(!IRQX) ; also sheet 4
!BNMI: PC0.61(!NMI) ; also sheet 1
!BRD: PC0.21(!RD) ; also sheet 1,5
!BRST: PC0.14(!RST) ; also sheet 1
!BWAIT: PC0.18(!WAIT) ; also sheet 1
!BWR: PC0.22(!WR) ; also sheet 1,5
!HALT: R2.1 ; also sheet 1
BA0: PC0.23(A0) ; also sheet 1,5
BA1: PC0.24(A1) ; also sheet 1
BA2: PC0.25(A2) ; also sheet 1
BA3: PC0.26(A3) ; also sheet 1
BA4: PC0.27(A4) ; also sheet 1
BA5: PC0.28(A5) ; also sheet 1,5
BA6: PC0.29(A6) ; also sheet 1,5
BA7: PC0.30(A7) ; also sheet 1,5
BA8: PC0.31(A8) ; also sheet 1
BA9: PC0.32(A9) ; also sheet 1
BA10: PC0.33(A10) ; also sheet 1
BA11: PC0.34(A11) ; also sheet 1
BA12: PC0.35(A12) ; also sheet 1
BA13: PC0.36(A13) ; also sheet 1
BA14: PC0.37(A14) ; also sheet 1
BA15: PC0.38(A15) ; also sheet 1
BA16: PC0.39(A16) ; also sheet 2
BA17: PC0.40(A17) ; also sheet 2
BA18: PC0.41(A18) ; also sheet 2
BA19: PC0.42(A19) ; also sheet 2
BCLK: PC0.15(CLK) ; also sheet 1
BD0: PC0.43(D0) ; also sheet 1,2,3,5
BD1: PC0.44(D1) ; also sheet 1,2,3,5
BD2: PC0.45(D2) ; also sheet 1,2,3,5
BD3: PC0.46(D3) ; also sheet 1,2,3,5
BD4: PC0.47(D4) ; also sheet 1,2,3,5
BD5: PC0.48(D5) ; also sheet 1,2,3,5
BD6: PC0.49(D6) ; also sheet 1,2,3,5
BD7: PC0.50(D7) ; also sheet 1,2,3,5
GND [GND]: C1.2 C2.2 C3.2 C4.2 C5.2 C6.2 C7.2 C8.2 C9.2 C10.2 C11.2 C12.2 C13.2 C14.2 C15.2 C16.2 C17.2 C18.2 C19.2 C20.2 C21.2 C22.2 C23.2 C24.2 C25.2 C26.2 C27.2 C28.2 C29.2 D1.K(C) PC0.3(GND) PC0.4(GND) PC0.62(GND) ; also sheet 1,2,3,4
N$20: Q1.2(B) R2.2
N$24: Q1.3(C) R1.2
N$26: D1.A R1.1
VCC: C1.1 C2.1 C3.1 C4.1 C5.1 C6.1 C7.1 C8.1 C9.1 C10.1 C11.1 C12.1 C13.1 C14.1 C15.1 C16.1 C17.1 C18.1 C19.1 C20.1 C21.1 C22.1 C23.1 C24.1 C25.1 C26.1 C27.1 C28.1 C29.1 PC0.5(+5V) PC0.6(+5V) Q1.1(E) U3.3(B:I0) U3.4(B:I1) U3.5(B:I2) U3.9(C:I0) U3.10(C:I1) U3.11(C:I2) ; also sheet 1,2,3,4,5
Unconnected: PC0.1(+12V) PC0.2(+3.3V) PC0.7(-12V) PC0.8(+5VSB) PC0.10(!BUSRQ) PC0.13(!CINH) PC0.16(CLKAUX) U3.6(B:O) U3.8(C:O)

### Buses
BD[0..7]
BA[0..19],!BRD,!BWR,!BCSX

### Notes on the sheet
- DATA BUS
- ADDRESS BUS
- Bus Connector/Misc.
- Project: | Chris Weir
- V1.0 | Sheet:

## Power pins joined to a net without a drawn wire
GND: U1.8(GND) U2.8(GND) U3.7(P:GND) U4.7(P:GND) U5.8(GND) U6.10(GND) U7.10(GND) U8.10(P:GND) U9.7(P:GND) U10.7(P:GND) U11.10(GND) U12.10(P:GND) U13.10(P:GND) U14.10(P:GND) U15.10(GND) U16.10(GND) U17.7(P:GND) U18.7(P:GND) U19.7(P:GND) U20.21(GND) U21.10(P:GND) U22.8(GND) U23.8(GND) U24.10(P:GND) U25.10(P:GND) U26.10(GND) U27.7(P:GND) U28.7(P:GND)
VCC: U1.16(VCC) U2.16(VCC) U3.14(P:VCC) U4.14(P:VCC) U5.16(VCC) U6.20(VCC) U7.20(VCC) U8.20(P:VCC) U9.14(P:VCC) U10.14(P:VCC) U11.20(VCC) U12.20(P:VCC) U13.20(P:VCC) U14.20(P:VCC) U15.20(VCC) U16.20(VCC) U17.14(P:VCC) U18.14(P:VCC) U19.14(P:VCC) U20.8(VCC) U21.20(P:VCC) U22.16(VCC) U23.16(VCC) U24.20(P:VCC) U25.20(P:VCC) U26.20(VCC) U27.14(P:VCC) U28.14(P:VCC)

## Library data of the parts
C1-C29 = resistor:C-US: CAPACITOR, American symbol
D1 = led:LED: LED OSRAM: - CHIPLED LG R971, LG N971, LY N971, LG Q971, LY Q971, LO R971, LY R971 LH N974, LH R974 LS Q976, LO Q976, LY Q976 LO Q996 - Hyper CHIPLED LW Q18S LB Q993, LB Q99A, LB R99A - SideLED LS A670, LO A670, LY A670, LG A670, LP A670 LB A673, LV A673, LT A673, LW A673 LH A674 LY A675 LS A676, LA A676, LO A676, LY A676, LW A676 LS A679, LY A679, LG A679 - Hyper Micro SIDELED® LS Y876, LA Y876, LO Y876, LY Y876 LT Y87S - SmartLED LW L88C, LW L88S LB L89C, LB L89S, LG L890 LS L89K, LO L89K, LY L89K LS L896, LA L896, LO L896, LY L896 - TOPLED LS T670, LO T670, LY T670, LG T670, LP T670 LSG T670, LSP T670, LSY T670, LOP T670, LYG T670 LG T671, LOG T671, LSG T671 LB T673, LV T673, LT T673, LW T673 LH T674 LS T676, LA T676, LO T676, LY T676, LB T676, LH T676, LSB T676, LW T676 LB T67C, LV T67C, LT T67C, LS T67K, LO T67K, LY T67K, LW E67C LS E67B, LA E67B, LO E67B, LY E67B, LB E67C, LV E67C, LT E67C LW T67C LS T679, LY T679, LG T679 LS T770, LO T770, LY T770, LG T770, LP T770 LB T773, LV T773, LT T773, LW T773 LH T774 LS E675, LA E675, LY E675, LS T675 LS T776, LA T776, LO T776, LY T776, LB T776 LHGB T686 LT T68C, LB T68C - Hyper Mini TOPLED® LB M676 - Mini TOPLED Santana® LG M470 LS M47K, LO M47K, LY M47K Source: http://www.osram.convergy.de LUXEON: - LUMILED® LXK2-PW12-R00, LXK2-PW12-S00, LXK2-PW14-U00, LXK2-PW14-V00 LXK2-PM12-R00, LXK2-PM12-S00, LXK2-PM14-U00 LXK2-PE12-Q00, LXK2-PE12-R00, LXK2-PE12-S00, LXK2-PE14-T00, LXK2-PE14-U00 LXK2-PB12-K00, LXK2-PB12-L00, LXK2-PB12-M00, LXK2-PB14-N00, LXK2-PB14-P00, LXK2-PB14-Q00 LXK2-PR12-L00, LXK2-PR12-M00, LXK2-PR14-Q00, LXK2-PR14-R00 LXK2-PD12-Q00, LXK2-PD12-R00, LXK2-PD12-S00 LXK2-PH12-R00, LXK2-PH12-S00 LXK2-PL12-P00, LXK2-PL12-Q00, LXK2-PL12-R00 Source: www.luxeon.com KINGBRIGHT: KA-3528ASYC Source: www.kingbright.com
JP1 JP2 JP5 = Custom:PINHD-1X2THRU
JP3 JP4 = Custom:PINHD1X3THRU
PC0 = Custom:XMICRO-BUS
Q1 = Custom:TRANSISTOR-PNP
R1-R6 = resistor:R-US_: RESISTOR, American symbol
U1 U2 U22 = 74xx-us:74*138: 3-line to 8-line DECODER/DEMULTIPLEXER
U3 = 74xx-us:74*10: Triple 3-input NAND gate
U4 U19 = 74xx-us:74*04: Hex INVERTER
U5 = 74xx-us:74*257: Quadruple 2-to 1 line data SELECTOR/MULTIPLEXER
U6 U7 = 74xx-us:74*688: 8-bit MAGNITUDE/IDENTITY COMPARATOR, totem pole
U8 U12-U14 U21 U24 U25 = 74xx-us:74*244: Octal BUFFER and LINE DRIVER, 3-state
U9 U10 = 74xx-us:74*74: Dual D type positive edge triggered FLIP FLOP, preset and clear
U11 U26 = 74xx-us:74*273: Octal D type FLIP FLOP, clear
U15 = 74xx-us:74*245: Octal BUS TRANSCEIVER, 3-state
U16 = 74xx-us:74*574: 8-bit D type FLIP FLOP bus driver
U17 = 74xx-us:74*00: Quad 2-input NAND gate
U18 = 74xx-us:74*08: Quad 2-input AND gate
U20 = Custom:W65C02
U23 = 74xx-us:74*148: 10-line to 4-line and 8-line to 3-line PRIORITY ENCODER
U27 U28 = 74xx-us:74*32: Quad 2-input OR gate
Y1 = crystal:QG5460: CRYSTAL RESONATOR; OC_FARNELL: unknown; OC_NEWARK: unknown

## Net classes
1 GND: width 0.254 mm, clearance 0.305 mm